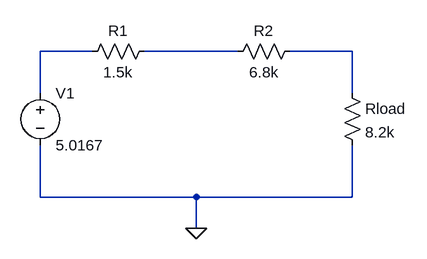
[diagram p0: schematic Draft1.asc]
Draft1.asc, the LTspice schematic file:
Version 4
SHEET 1 880 680
WIRE 128 16 48 16
WIRE 352 16 208 16
WIRE 528 16 432 16
WIRE 48 80 48 16
WIRE 528 80 528 16
WIRE 48 240 48 160
WIRE 288 240 48 240
WIRE 528 240 528 160
WIRE 528 240 288 240
WIRE 288 288 288 240
FLAG 288 288 0
SYMBOL voltage 48 64 R0
WINDOW 123 0 0 Left 0
WINDOW 39 0 0 Left 0
SYMATTR InstName V1
SYMATTR Value 5.0167
SYMBOL res 512 64 R0
SYMATTR InstName Rload
SYMATTR Value 8.2k
SYMBOL res 224 0 R90
WINDOW 0 0 56 VBottom 2
WINDOW 3 32 56 VTop 2
SYMATTR InstName R1
SYMATTR Value 1.5k
SYMBOL res 448 0 R90
WINDOW 0 0 56 VBottom 2
WINDOW 3 32 56 VTop 2
SYMATTR InstName R2
SYMATTR Value 6.8k

The netlist it stands for:
* Draft1.asc
V1 N001 0 5.0167
Rload N003 0 8.2k
R1 N002 N001 1.5k
R2 N003 N002 6.8k
.backanno
.end